# Altium schematic sheet ZeroCrossing.SchDoc
size A4; SheetNumber: 7; SheetTotal: 10
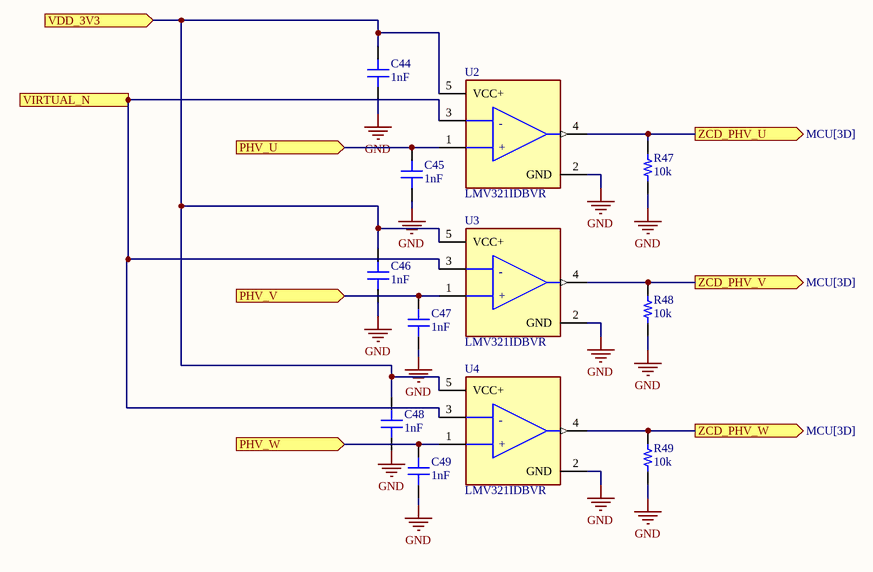
[diagram p0: ZeroCrossing.SchDoc]

## Parts
C44  1nF  [CAP 0603_1608]
C45  1nF  [CAP 0603_1608]
C46  1nF  [CAP 0603_1608]
C47  1nF  [CAP 0603_1608]
C48  1nF  [CAP 0603_1608]
C49  1nF  [CAP 0603_1608]
R47  10k  [RES 0402_1005]
R48  10k  [RES 0402_1005]
R49  10k  [RES 0402_1005]
U2  LMV321IDBVR  [FP-DBV0005A-MFG]
U3  LMV321IDBVR  [FP-DBV0005A-MFG]
U4  LMV321IDBVR  [FP-DBV0005A-MFG]

## Ports
PHV_U (in, see ADC_Input_protection[2B], MCU[3C], PhaseVoltage[1A]), PHV_V (in, see ADC_Input_protection[3B], MCU[3B], PhaseVoltage[1A]), PHV_W (in, see ADC_Input_protection[3B], MCU[3C], PhaseVoltage[2A]), VDD_3V3 (in, see ADC_Input_protection[3C], DC-DC_Buck_Converter+12Vto+3.3V[3C], DC_Current_Voltage_Measurement[3B], MCU[1B], MotorDrivers[1A], MotorDrivers[1B], Power[2D]), VIRTUAL_N (in, see ADC_Input_protection[4B], MCU[3C]), ZCD_PHV_U (out, see MCU[3D]), ZCD_PHV_V (out, see MCU[3D]), ZCD_PHV_W (out, see MCU[3D])

## Nets
GND: C44.1 C45.1 C46.1 C47.1 C48.1 C49.1 R47.1 R48.1 R49.1 U2.2(GND) U2.3(1IN-) U3.2(GND) U3.3(1IN-) U4.2(GND) U4.3(1IN-) ; port VIRTUAL_N
PHV_U: C45.2 U2.1(1IN+) ; port PHV_U
PHV_V: C47.2 U3.1(1IN+) ; port PHV_V
PHV_W: C49.2 U4.1(1IN+) ; port PHV_W
VDD_3V3: C44.2 C46.2 C48.2 U2.5(VCC+) U3.5(VCC+) U4.5(VCC+) ; port VDD_3V3
ZCD_PHV_U: R47.2 U2.4(OUT) ; port ZCD_PHV_U
ZCD_PHV_V: R48.2 U3.4(OUT) ; port ZCD_PHV_V
ZCD_PHV_W: R49.2 U4.4(OUT) ; port ZCD_PHV_W

## Notes on the sheet
- (in symbol CMP-04895-000056-1) -; +

## Library data of the parts
C44-C49 = 0603ZC102KAT2A: CAP CER 1000PF 10V X7R 0603; manufacturer: AVX Corporation; Tolerance: ±10%; Part Number: 0603ZC102KAT2A; Value: 1nF; Applications: General Purpose; Capacitance: 1nF; componentlink1description: Datasheet; componentlink1url: http://datasheets.avx.com/X7RDielectric.pdf; componentlink2description: DigiKey Link; componentlink2url: http://digikey.com/product-detail/en/avx-corporation/0603ZC102KAT2A/478-0603ZC102KAT2ACT-ND/11570315; Device Package: 0603 (1608 Metric); lastupdated: 2.09.2020 01:02:55; Lifecycle Status: Active; Minimum Order: 1; Mounting Type: Surface Mount, MLCC; Operating Temperature: -55°C ~ 125°C; Package / Case: 0603 (1608 Metric); packaging: TapeAndReel; partid: 27370; Part Status: Active; price: 0.01; series: -; Supplier 1: DigiKey; Supplier Part Number 1: 478-0603ZC102KAT2ACT-ND; Temperature Coefficient: X7R; Voltage - Rated: 10V
R47-R49 = ESR01MZPF47R0: ANTI-SURGE CHIP RESISTORS; Manufacturer: Rohm Semiconductor; Power (Watts): 0.2W, 1/5W; Resistance: 10k Ohms; Temperature Coefficient: ±100ppm/°C; Tolerance: ±1%; Part Number: ESR01MZPF47R0; Value: 10k; ComponentLink1Description: Datasheet; ComponentLink1URL: https://fscdn.rohm.com/en/products/databook/datasheet/passive/resistor/chip_resistor/esr-e.pdf; ComponentLink2Description: DigiKey Link; ComponentLink2URL: https://www.digikey.com/en/products/detail/rohm-semiconductor/ESR01MZPF47R0/16180187; Composition: Thick Film; Device Package: 0402 (1005 Metric); Features: Automotive AEC-Q200, Pulse Withstanding; Height - Seated (Max): 0.016" (0.40mm); LastUpdated: 5.10.2023 19:23:22; Lifecycle Status: Active; Minimum Order: 1; Number of Terminations: 2; Operating Temperature: -55°C ~ 155°C; Package / Case: 0402 (1005 Metric); Packaging: TapeAndReel; PartId: 67421; Part Status: Active; Price: 0.03; Ratings: AEC-Q200; Series: ESR; Size / Dimension: 0.039" L x 0.020" W (1.00mm x 0.50mm); Supplier 1: DigiKey; Supplier Part Number 1: 511-ESR01MZPF47R0CT-ND; Supplier Device Package: 0402
U2-U4 = CMP-04895-000056-1: IC OPAMP GP 1 CIRCUIT SOT23-5; Manufacturer: Texas Instruments; Bandwidth: 1MHz; Number Of Channels: 1; Max Junction Temp: +150°C; Input Offset Voltage: 1.7mV; Standoff Height: 0mm; Voltage Gain: 100V/mV; Min Supply Voltage: 2.7V; Input Bias Current: 0.015uA; Nominal Supply Current: 80-130uA; Max Supply Voltage: 5.5V; Ambient Temperature Range Low: -40°C; Device Class L3: Amplifiers - Op Amps; Package: DBV0005A; Temperature: -40°C to +125°C; Automotive: No; Ambient Temperature Range High: +125°C; ComponentLink2Description: Datasheet; Manufacturer Part Number: LMV321IDBVR; Octopart: https://octopart.com/lmv321idbvr-texas+instruments-410381; ComponentLink2URL: http://www.ti.com/lit/ds/symlink/lmv321.pdf; Temperature Range High: +125°C; Device Class L1: Integrated Circuits (ICs); Temperature Range Low: -40°C; Digikey Description: IC OPAMP GP 1 CIRCUIT SOT23-5; RoHS: TRUE; Height: 1.45mm; Mouser Description: Operational Amplifiers - Op Amps Low V R/R; Device Class L2: Linear ICs; Gain Bandwidth: 1MHz; Lead Free: Yes; Category: IC